# Altium schematic sheet ejemplo_solenoide.SchDoc
size 152 x 101 mm
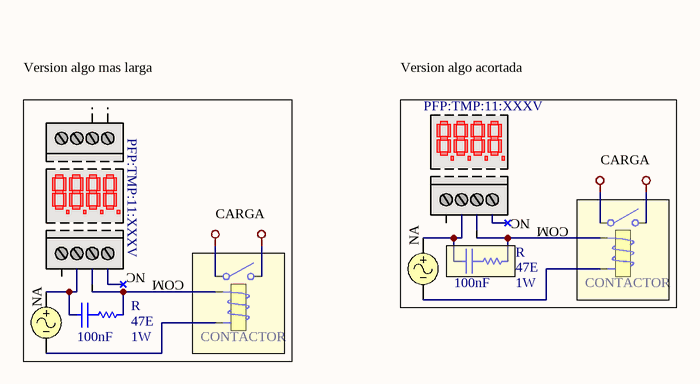
[diagram p0: ejemplo_solenoide.SchDoc]

## Parts
(Parts that share a designator on the sheet are numbered #1, #2 ... from top to bottom, then left to right.)
C?#1  value 100nF  [c1206]  (hidden comment: Cap)
C?#2  value 100nF  [c1206]  (hidden comment: Cap)
CONTACTOR#1  Relay  [Relay Omron G2R-1A]  (value not drawn)
CONTACTOR#2  Relay  [Relay Omron G2R-1A]  (value not drawn)
R#1  value 47E  Power: 1W  [1206NP]  (hidden comment: Res)
R#2  value 47E  Power: 1W  [1206NP]  (hidden comment: Res)
V?#1  (no value)
V?#2  (no value)

## Nets
NetCONTACTOR#1_1: CONTACTOR#1.1 CONTACTOR#1.2 CONTACTOR#2.1 CONTACTOR#2.2
NetC?#1_1: C?#1.1 R#1.2
NetC?#1_2: C?#1.2 V?#1.1
NetC?#2_1: C?#2.1 R#2.2
NetC?#2_2: C?#2.2 V?#2.1
NetCONTACTOR#1_3: CONTACTOR#1.3 R#1.1
NetCONTACTOR#1_4: CONTACTOR#1.4 V?#1.2
NetCONTACTOR#2_3: CONTACTOR#2.3 R#2.1
NetCONTACTOR#2_4: CONTACTOR#2.4 V?#2.2

## Notes on the sheet
- Version algo mas larga
- Version algo acortada
- PFP:TMP:11:XXXV
- (near CONTACTOR#1) CARGA
- (near CONTACTOR#2) CARGA
- (near V?#1) NA
- NC
- COM
- (near V?#2) NA

## Library data of the parts
C?#1 C?#2 = Cap: Capacitor; Voltage: 50V; Price: 0.25; Technology: Ceramic
R#1 R#2 = Res: Resistor; Price: 0.036
V?#1 V?#2 = VSIN: Sinusoidal Voltage Source; Note: PCB Footprint - Not required; Published: 8-Jun-2000; LatestRevisionDate: 15-Nov-2004; LatestRevisionNote: Corrected Netlist.; PackageReference: Not Applicable; Publisher: Altium Limited
CONTACTOR#1 CONTACTOR#2 = Relay: Price: ?; Current: ?